# Altium schematic sheet [06]CPU-PWR.SchDoc
size A4
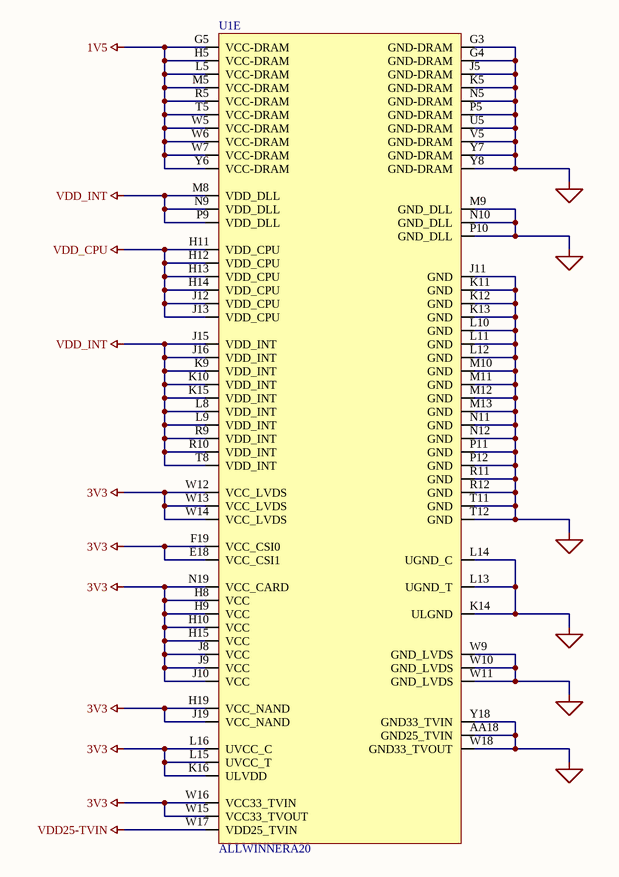
[diagram p0: [06]CPU-PWR.SchDoc]

## Parts
U1  MPN: ALLWINNERA20  [A20]  (hidden comment: Allwinner A20 SOC)  (part E of 5)

## Nets
1V5: U1.G5(VCC-DRAM) U1.H5(VCC-DRAM) U1.L5(VCC-DRAM) U1.M5(VCC-DRAM) U1.R5(VCC-DRAM) U1.T5(VCC-DRAM) U1.W5(VCC-DRAM) U1.W6(VCC-DRAM) U1.W7(VCC-DRAM) U1.Y6(VCC-DRAM)
3V3: U1.E18(VCC_CSI1) U1.F19(VCC_CSI0) U1.H8(VCC) U1.H9(VCC) U1.H10(VCC) U1.H15(VCC) U1.H19(VCC_NAND) U1.J8(VCC) U1.J9(VCC) U1.J10(VCC) U1.J19(VCC_NAND) U1.K16(ULVDD) U1.L15(UVCC_T) U1.L16(UVCC_C) U1.N19(VCC_CARD) U1.W12(VCC_LVDS) U1.W13(VCC_LVDS) U1.W14(VCC_LVDS) U1.W15(VCC33_TVOUT) U1.W16(VCC33_TVIN)
SGND: U1.AA18(GND25_TVIN) U1.G3(GND-DRAM) U1.G4(GND-DRAM) U1.J5(GND-DRAM) U1.J11(GND) U1.K5(GND-DRAM) U1.K11(GND) U1.K12(GND) U1.K13(GND) U1.K14(ULGND) U1.L10(GND) U1.L11(GND) U1.L12(GND) U1.L13(UGND_T) U1.L14(UGND_C) U1.M9(GND_DLL) U1.M10(GND) U1.M11(GND) U1.M12(GND) U1.M13(GND) U1.N5(GND-DRAM) U1.N10(GND_DLL) U1.N11(GND) U1.N12(GND) U1.P5(GND-DRAM) U1.P10(GND_DLL) U1.P11(GND) U1.P12(GND) U1.R11(GND) U1.R12(GND) U1.T11(GND) U1.T12(GND) U1.U5(GND-DRAM) U1.V5(GND-DRAM) U1.W9(GND_LVDS) U1.W10(GND_LVDS) U1.W11(GND_LVDS) U1.W18(GND33_TVOUT) U1.Y7(GND-DRAM) U1.Y8(GND-DRAM) U1.Y18(GND33_TVIN)
VDD25-TVIN: U1.W17(VDD25_TVIN)
VDD_CPU: U1.H11(VDD_CPU) U1.H12(VDD_CPU) U1.H13(VDD_CPU) U1.H14(VDD_CPU) U1.J12(VDD_CPU) U1.J13(VDD_CPU)
VDD_INT: U1.J15(VDD_INT) U1.J16(VDD_INT) U1.K9(VDD_INT) U1.K10(VDD_INT) U1.K15(VDD_INT) U1.L8(VDD_INT) U1.L9(VDD_INT) U1.M8(VDD_DLL) U1.N9(VDD_DLL) U1.P9(VDD_DLL) U1.R9(VDD_INT) U1.R10(VDD_INT) U1.T8(VDD_INT)

## Library data of the parts
U1 = ALLWINNER-A20